# Altium schematic sheet k210.SchDoc: k210-cam
size 431 x 304 mm; Author: enpeicv; CompanyName: enpeicv; DrawnBy: D:\SoftwareTools\Altium Designer\logo\vsky\Slide1.png; Organization: enpeicv; Address1: enpeicv.com; DocumentNumber: course-01; Revision: v0.1.2; SheetNumber: 1; SheetTotal: 1; ImagePath: D:\SoftwareTools\Altium Designer\logo\vsky\Slide1.png; Application_BuildNumber: ss
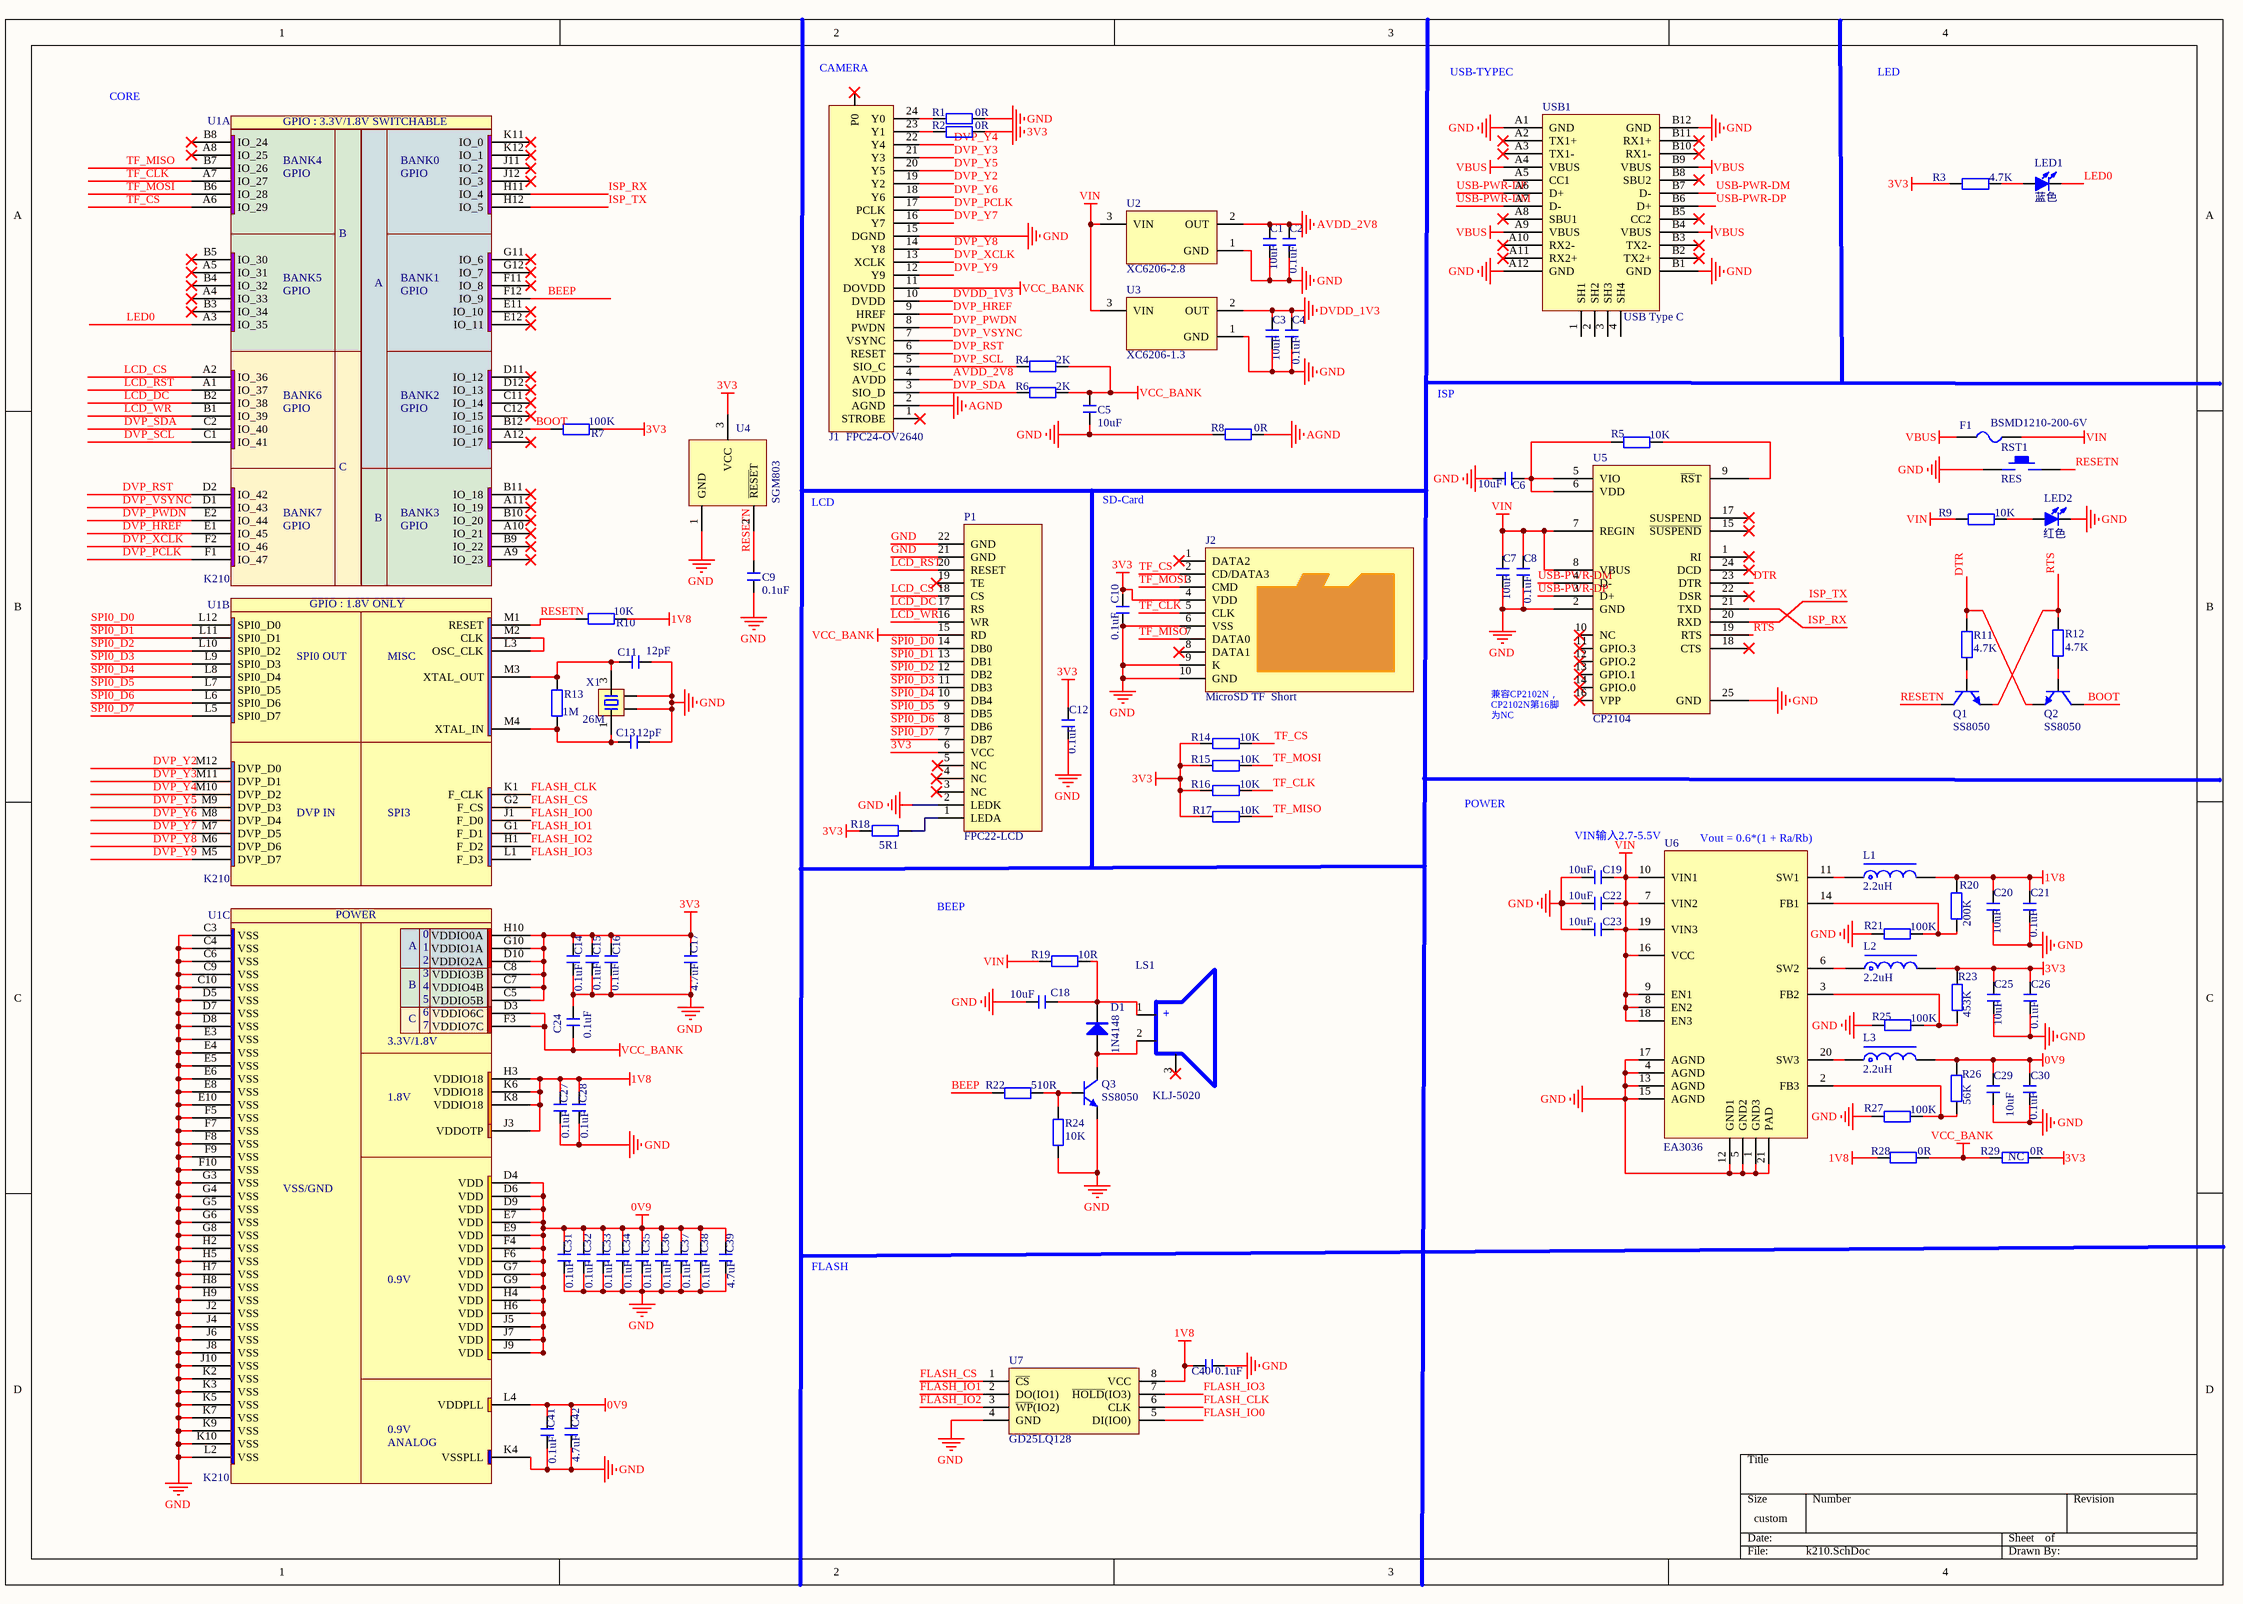
[diagram p0: k210.SchDoc]

## Parts
C1  10uF  [C 0402_M]
C2  0.1uF  [C 0402_M]
C3  10uF  [C 0402_M]
C4  0.1uF  [C 0402_M]
C5  10uF  [C 0402_M]
C6  10uF  [C 0402_M]
C7  10uF  [C 0402_M]
C8  0.1uF  [C 0402_M]
C9  0.1uF  [C 0402_M]
C10  0.1uF  [C 0402_M]
C11  12pF  [C 0402_M]
C12  0.1uF  [C 0402_M]
C13  12pF  [C 0402_M]
C14  0.1uF  [C 0402_M]
C15  0.1uF  [C 0402_M]
C16  0.1uF  [C 0402_M]
C17  4.7uF  [C 0402_M]
C18  10uF  [C 0402_M]
C19  10uF  [C 0402_M]
C20  10uF  [C 0402_M]
C21  0.1uF  [C 0402_M]
C22  10uF  [C 0402_M]
C23  10uF  [C 0402_M]
C24  0.1uF  [C 0402_M]
C25  10uF  [C 0402_M]
C26  0.1uF  [C 0402_M]
C27  0.1uF  [C 0402_M]
C28  0.1uF  [C 0402_M]
C29  10uF  [C 0402_M]
C30  0.1uF  [C 0402_M]
C31  0.1uF  [C 0402_M]
C32  0.1uF  [C 0402_M]
C33  0.1uF  [C 0402_M]
C34  0.1uF  [C 0402_M]
C35  0.1uF  [C 0402_M]
C36  0.1uF  [C 0402_M]
C37  0.1uF  [C 0402_M]
C38  0.1uF  [C 0402_M]
C39  4.7uF  [C 0402_M]
C40  0.1uF  [C 0402_M]
C41  0.1uF  [C 0402_M]
C42  4.7uF  [C 0402_M]
D1  1N4148  [SOD-323]
F1  BSMD1210-200-6V  [FU 1210]
J1  FPC24-OV2640  [FPC0.5 2H-WS-24P]
J2  MicroSD TF  Short  [TF-SOCKET - short]
L1  2.2uH  [NR2520]
L2  2.2uH  [NR2520]
L3  2.2uH  [NR2520]
LED1  蓝色  [LED 0805G]
LED2  红色  [LED 0805G]
LS1  KLJ-5020  [BUZ-SMD_4P-L5.0-W5.0-P3.80-TL]
P1  FPC22-LCD  [FPC0.5 2H-WS-22P]
Q1  SS8050  [SOT23-3N]
Q2  SS8050  [SOT23-3N]
Q3  SS8050  [SOT23-3N]
R1  0R  [R 0402_M]
R2  0R  [R 0402_M]
R3  4.7K  [R 0402_M]
R4  2K  [R 0402_M]
R5  10K  [R 0402_M]
R6  2K  [R 0402_M]
R7  100K  [R 0402_M]
R8  0R  [R 0402_M]
R9  10K  [R 0402_M]
R10  10K  [R 0402_M]
R11  4.7K  [R 0402_M]
R12  4.7K  [R 0402_M]
R13  1M  [R 0402_M]
R14  10K  [R 0402_M]
R15  10K  [R 0402_M]
R16  10K  [R 0402_M]
R17  10K  [R 0402_M]
R18  5R1  [R 0402_M]
R19  10R  [R 0402_M]
R20  200K  [R 0402_M]
R21  100K  [R 0402_M]
R22  510R  [R 0402_M]
R23  453K  [R 0402_M]
R24  10K  [R 0402_M]
R25  100K  [R 0402_M]
R26  56K  [R 0402_M]
R27  100K  [R 0402_M]
R28  0R  [R 0402_M]
R29  0R  [R 0402_M]
RST1  RES  [SMD-3.2*4.2]
U1  K210  [BGA144C65P12X12_800X800X95]  (parts A,B,C of 3)
U2  XC6206-2.8  [SOT23-3N]
U3  XC6206-1.3  [SOT23-3N]
U4  SGM803  [SOT23-3N]
U5  CP2104  [QFN-24_L4.0-W4.0-P0.50-BL-EP2.8]
U6  EA3036  [QFN20_40P300X300X80_HS-21N]
U7  GD25LQ128  [WSON-8_L8.0-W6.10-P1.27-BL-EP]
USB1  USB Type C  [Type-C-TOP]
X1  26M  [OSC 3225-4P]

## Nets
0V9: C29.2 C30.2 C31.1 C32.1 C33.1 C34.1 C35.1 C36.1 C37.1 C38.1 C39.1 C41.1 C42.1 L3.2 R26.2 U1.D4(VDD) U1.D6(VDD) U1.D9(VDD) U1.E7(VDD) U1.E9(VDD) U1.F4(VDD) U1.F6(VDD) U1.G7(VDD) U1.G9(VDD) U1.H4(VDD) U1.H6(VDD) U1.J5(VDD) U1.J7(VDD) U1.J9(VDD) U1.L4(VDDPLL)
1V8: C20.2 C21.2 C27.1 C28.1 C40.2 L1.2 R10.2 R20.2 R28.2 U1.H3(VDDIO18) U1.J3(VDDOTP) U1.K6(VDDIO18) U1.K8(VDDIO18) U7.8(VCC)
3V3: C10.1 C12.2 C14.2 C15.2 C16.2 C17.2 C25.2 C26.2 J2.4(VDD) L2.2 P1.6(VCC) R2.2 R3.1 R7.2 R14.1 R15.1 R16.1 R17.1 R18.1 R23.2 R29.1 U1.C5(VDDIO5B) U1.C7(VDDIO4B) U1.C8(VDDIO3B) U1.D10(VDDIO2A) U1.G10(VDDIO1A) U1.H10(VDDIO0A) U4.3(VCC)
AGND: J1.2(AGND) R8.2
AVDD_2V8: C1.2 C2.2 J1.4(AVDD) U2.2(OUT)
DVDD_1V3: C3.2 C4.2 J1.10(DVDD) U3.2(OUT)
GND: C1.1 C2.1 C3.1 C4.1 C5.2 C6.2 C7.1 C8.1 C9.2 C10.2 C11.2 C12.1 C13.2 C14.1 C15.1 C16.1 C17.1 C18.1 C19.2 C20.1 C21.1 C22.2 C23.2 C24.1 C25.1 C26.1 C27.2 C28.2 C29.1 C30.1 C31.2 C32.2 C33.2 C34.2 C35.2 C36.2 C37.2 C38.2 C39.2 C40.1 C41.2 C42.2 J1.15(DGND) J2.6(VSS) J2.9(K) J2.10(GND) LED2.2(K) P1.2(LEDK) P1.21(GND) P1.22(GND) Q3.2(E) R1.2 R8.1 R21.2 R24.1 R25.2 R27.2 RST1.1 U1.C3(VSS) U1.C4(VSS) U1.C6(VSS) U1.C9(VSS) U1.C10(VSS) U1.D5(VSS) U1.D7(VSS) U1.D8(VSS) U1.E3(VSS) U1.E4(VSS) U1.E5(VSS) U1.E6(VSS) U1.E8(VSS) U1.E10(VSS) U1.F5(VSS) U1.F7(VSS) U1.F8(VSS) U1.F9(VSS) U1.F10(VSS) U1.G3(VSS) U1.G4(VSS) U1.G5(VSS) U1.G6(VSS) U1.G8(VSS) U1.H2(VSS) U1.H5(VSS) U1.H7(VSS) U1.H8(VSS) U1.H9(VSS) U1.J2(VSS) U1.J4(VSS) U1.J6(VSS) U1.J8(VSS) U1.J10(VSS) U1.K2(VSS) U1.K3(VSS) U1.K4(VSSPLL) U1.K5(VSS) U1.K7(VSS) U1.K9(VSS) U1.K10(VSS) U1.L2(VSS) U2.1(GND) U3.1(GND) U4.1(GND) U5.2(GND) U5.25(GND) U6.1(GND3) U6.4(AGND) U6.5(GND2) U6.12(GND1) U6.13(AGND) U6.15(AGND) U6.17(AGND) U6.21(PAD) U7.4(GND) USB1.A1(GND) USB1.A12(GND) USB1.B1(GND) USB1.B12(GND) X1.2 X1.4
VBUS: F1.1 USB1.A4(VBUS) USB1.A9(VBUS) USB1.B4(VBUS) USB1.B9(VBUS)
VCC_BANK: C5.1 C24.2 J1.11(DOVDD) P1.15(RD) R4.2 R6.2 R28.1 R29.2 U1.D3(VDDIO6C) U1.F3(VDDIO7C)
VIN: C7.2 C8.2 C19.1 C22.1 C23.1 F1.2 R9.1 R19.1 U2.3(VIN) U3.3(VIN) U5.7(REGIN) U5.8(VBUS) U6.7(VIN2) U6.8(EN2) U6.9(EN1) U6.10(VIN1) U6.16(VCC) U6.18(EN3) U6.19(VIN3)
BEEP: R22.1 U1.F12(IO_9)
BOOT: Q2.3(C) R7.1 U1.B12(IO_16)
DTR: Q2.2(E) R11.1 U5.23(DTR)
DVP_HREF: J1.9(HREF) U1.E1(IO_45)
DVP_PCLK: J1.17(PCLK) U1.F1(IO_47)
DVP_PWDN: J1.8(PWDN) U1.E2(IO_44)
DVP_RST: J1.6(RESET) U1.D2(IO_42)
DVP_SCL: J1.5(SIO_C) R4.1 U1.C1(IO_41)
DVP_SDA: J1.3(SIO_D) R6.1 U1.C2(IO_40)
DVP_VSYNC: J1.7(VSYNC) U1.D1(IO_43)
DVP_XCLK: J1.13(XCLK) U1.F2(IO_46)
DVP_Y2: J1.19(Y2) U1.M12(DVP_D0)
DVP_Y3: J1.21(Y3) U1.M11(DVP_D1)
DVP_Y4: J1.22(Y4) U1.M10(DVP_D2)
DVP_Y5: J1.20(Y5) U1.M9(DVP_D3)
DVP_Y6: J1.18(Y6) U1.M8(DVP_D4)
DVP_Y7: J1.16(Y7) U1.M7(DVP_D5)
DVP_Y8: J1.14(Y8) U1.M6(DVP_D6)
DVP_Y9: J1.12(Y9) U1.M5(DVP_D7)
FLASH_CLK: U1.K1(F_CLK) U7.6(CLK)
FLASH_CS: U1.G2(F_CS) U7.1(~{CS})
FLASH_IO0: U1.J1(F_D0) U7.5(DI(IO0))
FLASH_IO1: U1.G1(F_D1) U7.2(DO(IO1))
FLASH_IO2: U1.H1(F_D2) U7.3(~{WP}(IO2))
FLASH_IO3: U1.L1(F_D3) U7.7(~{HOLD}(IO3))
ISP_RX: U1.H11(IO_4) U5.21(TXD)
ISP_TX: U1.H12(IO_5) U5.20(RXD)
LCD_CS: P1.18(CS) U1.A2(IO_36)
LCD_DC: P1.17(RS) U1.B2(IO_38)
LCD_RST: P1.20(RESET) U1.A1(IO_37)
LCD_WR: P1.16(WR) U1.B1(IO_39)
LED0: LED1.2(K) U1.A3(IO_35)
RESETN: C9.1 Q1.3(C) R10.1 RST1.2 U1.M1(RESET) U4.2(~{RESE}T)
RTS: Q1.2(E) R12.1 U5.19(RTS)
SPI0_D0: P1.14(DB0) U1.L12(SPI0_D0)
SPI0_D1: P1.13(DB1) U1.L11(SPI0_D1)
SPI0_D2: P1.12(DB2) U1.L10(SPI0_D2)
SPI0_D3: P1.11(DB3) U1.L9(SPI0_D3)
SPI0_D4: P1.10(DB4) U1.L8(SPI0_D4)
SPI0_D5: P1.9(DB5) U1.L7(SPI0_D5)
SPI0_D6: P1.8(DB6) U1.L6(SPI0_D6)
SPI0_D7: P1.7(DB7) U1.L5(SPI0_D7)
TF_CLK: J2.5(CLK) R16.2 U1.A7(IO_27)
TF_CS: J2.2(CD/DATA3) R14.2 U1.A6(IO_29)
TF_MISO: J2.7(DATA0) R17.2 U1.B7(IO_26)
TF_MOSI: J2.3(CMD) R15.2 U1.B6(IO_28)
USB-PWR-DM: U5.4(D-) USB1.A7(D-) USB1.B7(D-)
USB-PWR-DP: U5.3(D+) USB1.A6(D+) USB1.B6(D+)
NetC6_1: C6.1 R5.2 U5.5(VIO) U5.6(VDD)
NetC11_1: C11.1 R13.2 U1.M3(XTAL_OUT) X1.3
NetC13_1: C13.1 R13.1 U1.M4(XTAL_IN) X1.1
NetC18_2: C18.2 D1.2(K) LS1.1 R19.2
NetD1_1: D1.1(A) LS1.2 Q3.3(C)
NetJ1_23: J1.23(Y1) R2.1
NetJ1_24: J1.24(Y0) R1.1
NetL1_1: L1.1 U6.11(SW1)
NetL2_1: L2.1 U6.6(SW2)
NetL3_1: L3.1 U6.20(SW3)
NetLED1_1: LED1.1(A) R3.2
NetLED2_1: LED2.1(A) R9.2
NetP1_1: P1.1(LEDA) R18.2
NetQ1_1: Q1.1(B) R11.2
NetQ2_1: Q2.1(B) R12.2
NetQ3_1: Q3.1(B) R22.2 R24.2
NetR5_1: R5.1 U5.9(~{RS}T)
NetR20_1: R20.1 R21.1 U6.14(FB1)
NetR23_1: R23.1 R25.1 U6.3(FB2)
NetR26_1: R26.1 R27.1 U6.2(FB3)
NetU1_L3: U1.L3(OSC_CLK) U1.M2(CLK)

Not connected (* = marked no-connect by the designer): J1 1(STROBE)* P0*; J2 1(DATA2)* 8(DATA1)*; LS1 3*; P1 3(NC) 4(NC) 5(NC)* 19(TE); U1 A4(IO_33)* A5(IO_31)* A8(IO_25)* A9(IO_23)* A10(IO_21)* A11(IO_19)* A12(IO_17)* B3(IO_34)* B4(IO_32)* B5(IO_30)* B8(IO_24)* B9(IO_22)* B10(IO_20)* B11(IO_18)* C11(IO_14)* C12(IO_15)* D11(IO_12)* D12(IO_13)* E11(IO_10)* E12(IO_11)* F11(IO_8)* G11(IO_6)* G12(IO_7)* J11(IO_2)* J12(IO_3)* K11(IO_0)* K12(IO_1)*; U5 1(RI)* 10(NC)* 11(GPIO.3)* 12(GPIO.2)* 13(GPIO.1)* 14(GPIO.0)* 15(~{SUSPEND})* 16(VPP)* 17(SUSPEND)* 18(CTS)* 22(DSR)* 24(DCD)*; USB1 1(SH1) 2(SH2) 3(SH3) 4(SH4) A2(TX1+)* A3(TX1-)* A5(CC1) A8(SBU1)* A10(RX2-)* A11(RX2+)* B2(TX2+)* B3(TX2-)* B5(CC2)* B8(SBU2)* B10(RX1-)* B11(RX1+)*

## Notes on the sheet
- CORE
- (near J1) CAMERA
- USB-TYPEC
- LED
- ISP
- SD-Card
- LCD
- (near U5) 兼容CP2102N，CP2102N第16脚为NC
- POWER
- VIN输入2.7-5.5V
- Vout = 0.6*(1 + Ra/Rb)
- BEEP
- (near R29) NC
- FLASH
- Title
- Size:
- Date:
- File:
- A2
- Number:
- Time:
- Revision:
- Sheet
- of
- (in symbol K210, part A) GPIO : 3.3V/1.8V SWITCHABLE; BANK4; BANK0; GPIO; B; BANK5; BANK1; A; BANK6; BANK2; C; BANK7; BANK3
- (in symbol K210, part B) GPIO : 1.8V ONLY; SPI0 OUT; MISC; DVP IN; SPI3
- (in symbol K210, part C) POWER; 0; A; 1; 2; 3; B; 4; 5; 6; C; 7; 3.3V/1.8V; 1.8V; VSS/GND; 0.9V; ANALOG
- (in symbol KLJ-5020) +

## Library data of the parts
C1-C42 = C: 贴片电容
D1 = 1N4148: 开关二极管
F1 = FU: 贴片保险丝
J1 = OV5640: Header, 24-Pin; pin to pad: 1>24 2>23 3>22 4>21 5>20 6>19 7>18 8>17 9>16 10>15 11>14 12>13 13>12 14>11 15>10 16>9 17>8 18>7 19>6 20>5 21>4 22>3 23>2 24>1; LatestRevisionDate: 17-Jul-2002; LatestRevisionNote: Re-released for DXP Platform.; Publisher: Altium Limited
J2 = TF_Card: TF卡座
L1-L3 = L-NR: NR磁胶电感
LED1 LED2 = LED-SMD: 贴片LED
LS1 = KLJ-5020: 蜂鸣器
P1 = FPC22_new
Q1-Q3 = 8050-SMD: 高频放大-NPN型
R1-R29 = R: 贴片电阻
RST1 = KEY_M
U1 = K210: Canaan Kendryte K210 AI SoC; VENDOR: CANAAN INC.
U2 U3 = XC6206-3.3: SOT-23,XC6206P332MR,MAX8V,100mA
U7 = GD25LQ128: WSON-8
USB1 = USB_Type-C
X1 = XTAL-4P: 4脚无源晶振